# Altium schematic sheet jammer.SchDoc
size A3
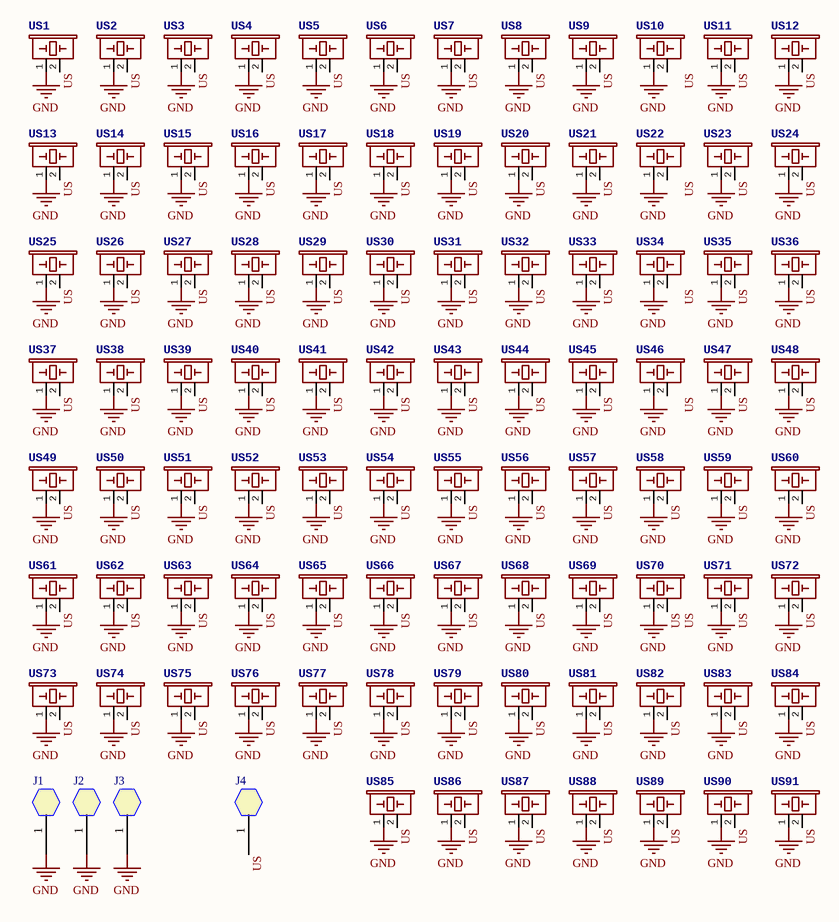
[diagram p0: jammer.SchDoc]

## Parts
J1  NutSolder  [NutSolder]  (value not drawn)
J2  NutSolder  [NutSolder]  (value not drawn)
J3  NutSolder  [NutSolder]  (value not drawn)
J4  NutSolder  [NutSolder]  (value not drawn)
US1  Comment  [400PT1601]  (value not drawn)
US2  (no value)  [400PT1601]
US3  Comment  [400PT1601]  (value not drawn)
US4  Comment  [400PT1601]  (value not drawn)
US5  Comment  [400PT1601]  (value not drawn)
US6  Comment  [400PT1601]  (value not drawn)
US7  Comment  [400PT1601]  (value not drawn)
US8  Comment  [400PT1601]  (value not drawn)
US9  Comment  [400PT1601]  (value not drawn)
US10  Comment  [400PT1601]  (value not drawn)
US11  Comment  [400PT1601]  (value not drawn)
US12  Comment  [400PT1601]  (value not drawn)
US13  Comment  [400PT1601]  (value not drawn)
US14  Comment  [400PT1601]  (value not drawn)
US15  Comment  [400PT1601]  (value not drawn)
US16  Comment  [400PT1601]  (value not drawn)
US17  Comment  [400PT1601]  (value not drawn)
US18  Comment  [400PT1601]  (value not drawn)
US19  Comment  [400PT1601]  (value not drawn)
US20  Comment  [400PT1601]  (value not drawn)
US21  Comment  [400PT1601]  (value not drawn)
US22  Comment  [400PT1601]  (value not drawn)
US23  Comment  [400PT1601]  (value not drawn)
US24  Comment  [400PT1601]  (value not drawn)
US25  Comment  [400PT1601]  (value not drawn)
US26  (no value)  [400PT1601]
US27  Comment  [400PT1601]  (value not drawn)
US28  Comment  [400PT1601]  (value not drawn)
US29  Comment  [400PT1601]  (value not drawn)
US30  Comment  [400PT1601]  (value not drawn)
US31  Comment  [400PT1601]  (value not drawn)
US32  Comment  [400PT1601]  (value not drawn)
US33  Comment  [400PT1601]  (value not drawn)
US34  Comment  [400PT1601]  (value not drawn)
US35  Comment  [400PT1601]  (value not drawn)
US36  Comment  [400PT1601]  (value not drawn)
US37  Comment  [400PT1601]  (value not drawn)
US38  Comment  [400PT1601]  (value not drawn)
US39  Comment  [400PT1601]  (value not drawn)
US40  Comment  [400PT1601]  (value not drawn)
US41  Comment  [400PT1601]  (value not drawn)
US42  Comment  [400PT1601]  (value not drawn)
US43  Comment  [400PT1601]  (value not drawn)
US44  Comment  [400PT1601]  (value not drawn)
US45  Comment  [400PT1601]  (value not drawn)
US46  Comment  [400PT1601]  (value not drawn)
US47  Comment  [400PT1601]  (value not drawn)
US48  Comment  [400PT1601]  (value not drawn)
US49  Comment  [400PT1601]  (value not drawn)
US50  (no value)  [400PT1601]
US51  Comment  [400PT1601]  (value not drawn)
US52  Comment  [400PT1601]  (value not drawn)
US53  Comment  [400PT1601]  (value not drawn)
US54  Comment  [400PT1601]  (value not drawn)
US55  Comment  [400PT1601]  (value not drawn)
US56  Comment  [400PT1601]  (value not drawn)
US57  Comment  [400PT1601]  (value not drawn)
US58  Comment  [400PT1601]  (value not drawn)
US59  Comment  [400PT1601]  (value not drawn)
US60  Comment  [400PT1601]  (value not drawn)
US61  Comment  [400PT1601]  (value not drawn)
US62  Comment  [400PT1601]  (value not drawn)
US63  Comment  [400PT1601]  (value not drawn)
US64  (no value)  [400PT1601]
US65  (no value)  [400PT1601]
US66  (no value)  [400PT1601]
US67  (no value)  [400PT1601]
US68  Comment  [400PT1601]  (value not drawn)
US69  Comment  [400PT1601]  (value not drawn)
US70  Comment  [400PT1601]  (value not drawn)
US71  Comment  [400PT1601]  (value not drawn)
US72  Comment  [400PT1601]  (value not drawn)
US73  Comment  [400PT1601]  (value not drawn)
US74  Comment  [400PT1601]  (value not drawn)
US75  Comment  [400PT1601]  (value not drawn)
US76  Comment  [400PT1601]  (value not drawn)
US77  Comment  [400PT1601]  (value not drawn)
US78  Comment  [400PT1601]  (value not drawn)
US79  Comment  [400PT1601]  (value not drawn)
US80  Comment  [400PT1601]  (value not drawn)
US81  Comment  [400PT1601]  (value not drawn)
US82  Comment  [400PT1601]  (value not drawn)
US83  Comment  [400PT1601]  (value not drawn)
US84  Comment  [400PT1601]  (value not drawn)
US85  Comment  [400PT1601]  (value not drawn)
US86  Comment  [400PT1601]  (value not drawn)
US87  Comment  [400PT1601]  (value not drawn)
US88  Comment  [400PT1601]  (value not drawn)
US89  Comment  [400PT1601]  (value not drawn)
US90  Comment  [400PT1601]  (value not drawn)
US91  Comment  [400PT1601]  (value not drawn)

## Nets
GND: J1.1 J2.1 J3.1 US1.1 US2.1 US3.1 US4.1 US5.1 US6.1 US7.1 US8.1 US9.1 US10.1 US11.1 US12.1 US13.1 US14.1 US15.1 US16.1 US17.1 US18.1 US19.1 US20.1 US21.1 US22.1 US23.1 US24.1 US25.1 US26.1 US27.1 US28.1 US29.1 US30.1 US31.1 US32.1 US33.1 US34.1 US35.1 US36.1 US37.1 US38.1 US39.1 US40.1 US41.1 US42.1 US43.1 US44.1 US45.1 US46.1 US47.1 US48.1 US49.1 US50.1 US51.1 US52.1 US53.1 US54.1 US55.1 US56.1 US57.1 US58.1 US59.1 US60.1 US61.1 US62.1 US63.1 US64.1 US65.1 US66.1 US67.1 US68.1 US69.1 US70.1 US71.1 US72.1 US73.1 US74.1 US75.1 US76.1 US77.1 US78.1 US79.1 US80.1 US81.1 US82.1 US83.1 US84.1 US85.1 US86.1 US87.1 US88.1 US89.1 US90.1 US91.1
US: J4.1 US1.2 US2.2 US3.2 US4.2 US5.2 US6.2 US7.2 US8.2 US9.2 US11.2 US12.2 US13.2 US14.2 US15.2 US16.2 US17.2 US18.2 US19.2 US20.2 US21.2 US23.2 US24.2 US25.2 US26.2 US27.2 US28.2 US29.2 US30.2 US31.2 US32.2 US33.2 US35.2 US36.2 US37.2 US38.2 US39.2 US40.2 US41.2 US42.2 US43.2 US44.2 US45.2 US47.2 US48.2 US49.2 US50.2 US51.2 US52.2 US53.2 US54.2 US55.2 US56.2 US57.2 US58.2 US59.2 US60.2 US61.2 US62.2 US63.2 US64.2 US65.2 US66.2 US67.2 US68.2 US69.2 US70.2 US71.2 US72.2 US73.2 US74.2 US75.2 US76.2 US77.2 US78.2 US79.2 US80.2 US81.2 US82.2 US83.2 US84.2 US85.2 US86.2 US87.2 US88.2 US89.2 US90.2 US91.2

Not connected (* = marked no-connect by the designer): US10 2; US22 2; US34 2; US46 2

## Notes on the sheet
- Labels drawn without touching a wire or pin: US

## Library data of the parts
US1-US91 = 400PT160: MF: Prowave; MP: 400PT160; Availability: Warning; Package: None; Price: 5.92 USD